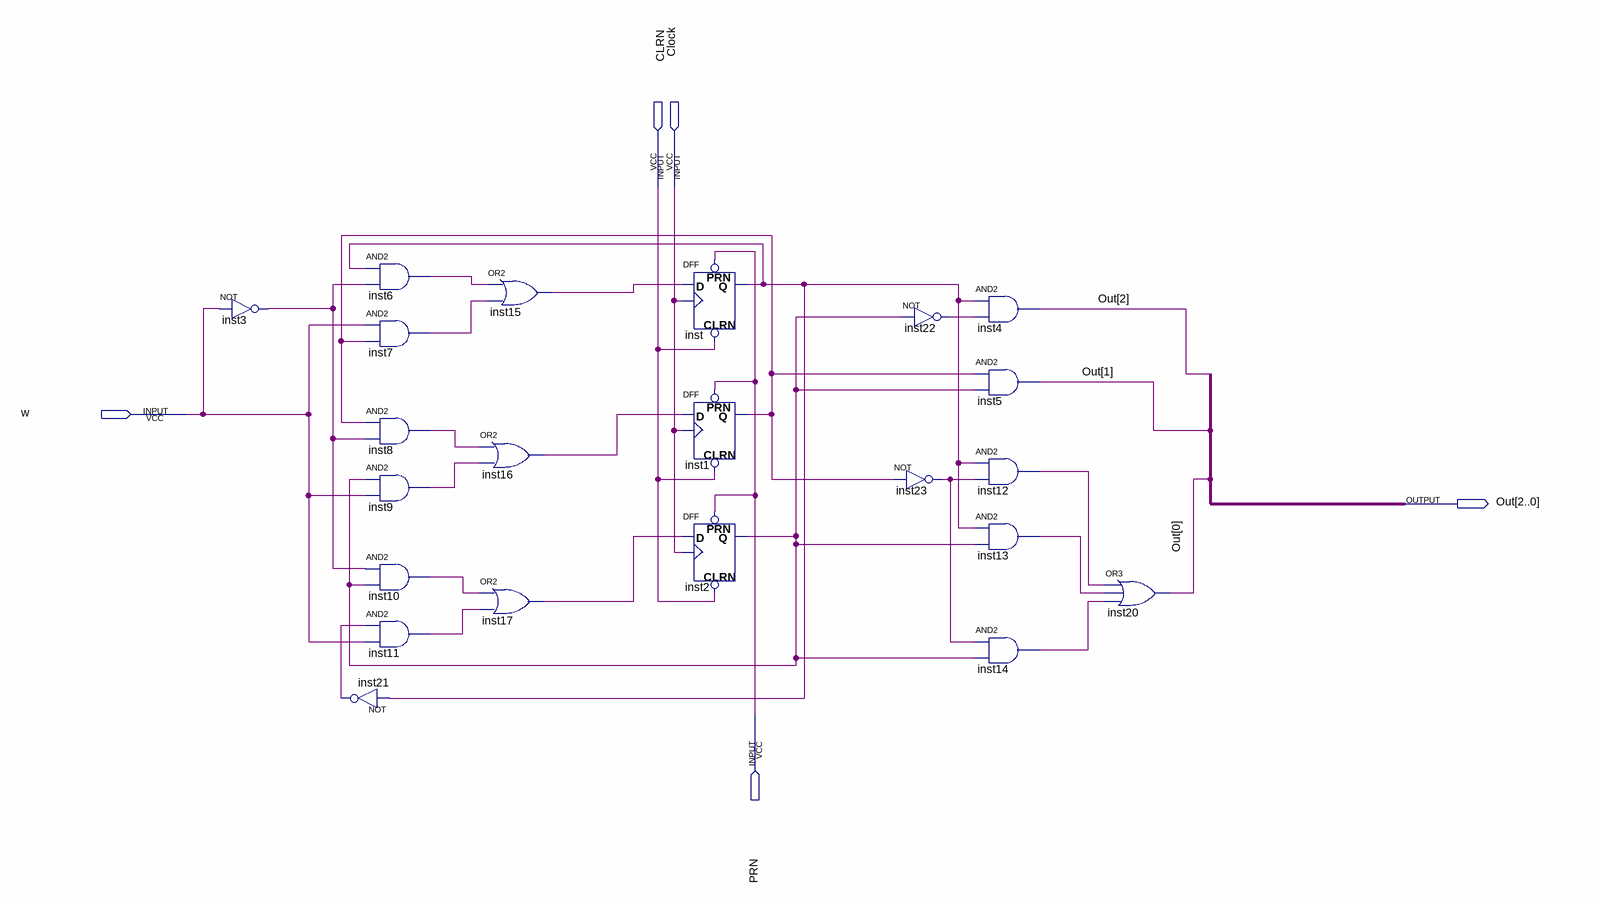
[diagram p0: schematic sheet]
// Quartus schematic lab11step1.bdf as structural Verilog: 22 symbols, 5 pins
module lab11step1 (
  input  CLRN,
  input  Clock,
  input  w,
  input  PRN,
  output [2:0] Out
);

  wire inst1_q, inst2_q, inst3_out, inst6_out, inst7_out, inst8_out, inst9_out, inst10_out, inst11_out,
       inst12_out, inst13_out, inst14_out, inst15_out, inst16_out, inst17_out, inst21_out, inst22_out,
       inst23_out, inst_q;

  not inst3 (inst3_out, w);
  not inst21 (inst21_out, inst_q);
  and inst6 (inst6_out, inst_q, inst3_out);
  and inst7 (inst7_out, w, inst1_q);
  and inst8 (inst8_out, inst1_q, inst3_out);
  and inst9 (inst9_out, inst2_q, w);
  and inst10 (inst10_out, inst3_out, inst2_q);
  and inst11 (inst11_out, inst21_out, w);
  or inst15 (inst15_out, inst6_out, inst7_out);
  or inst16 (inst16_out, inst8_out, inst9_out);
  or inst17 (inst17_out, inst10_out, inst11_out);
  DFF inst (.CLRN(CLRN), .CLK(Clock), .D(inst15_out), .PRN(PRN), .Q(inst_q));
  DFF inst1 (.CLRN(CLRN), .CLK(Clock), .D(inst16_out), .PRN(PRN), .Q(inst1_q));
  DFF inst2 (.CLRN(CLRN), .CLK(Clock), .D(inst17_out), .PRN(PRN), .Q(inst2_q));
  not inst22 (inst22_out, inst2_q);
  not inst23 (inst23_out, inst1_q);
  and inst4 (Out[2], inst_q, inst22_out);
  and inst5 (Out[1], inst1_q, inst2_q);
  and inst12 (inst12_out, inst_q, inst23_out);
  and inst13 (inst13_out, inst_q, inst2_q);
  and inst14 (inst14_out, inst23_out, inst2_q);
  or inst20 (Out[0], inst12_out, inst13_out, inst14_out);
endmodule
